# Altium project PCB_Project.PrjPcb (part 1 of 2)
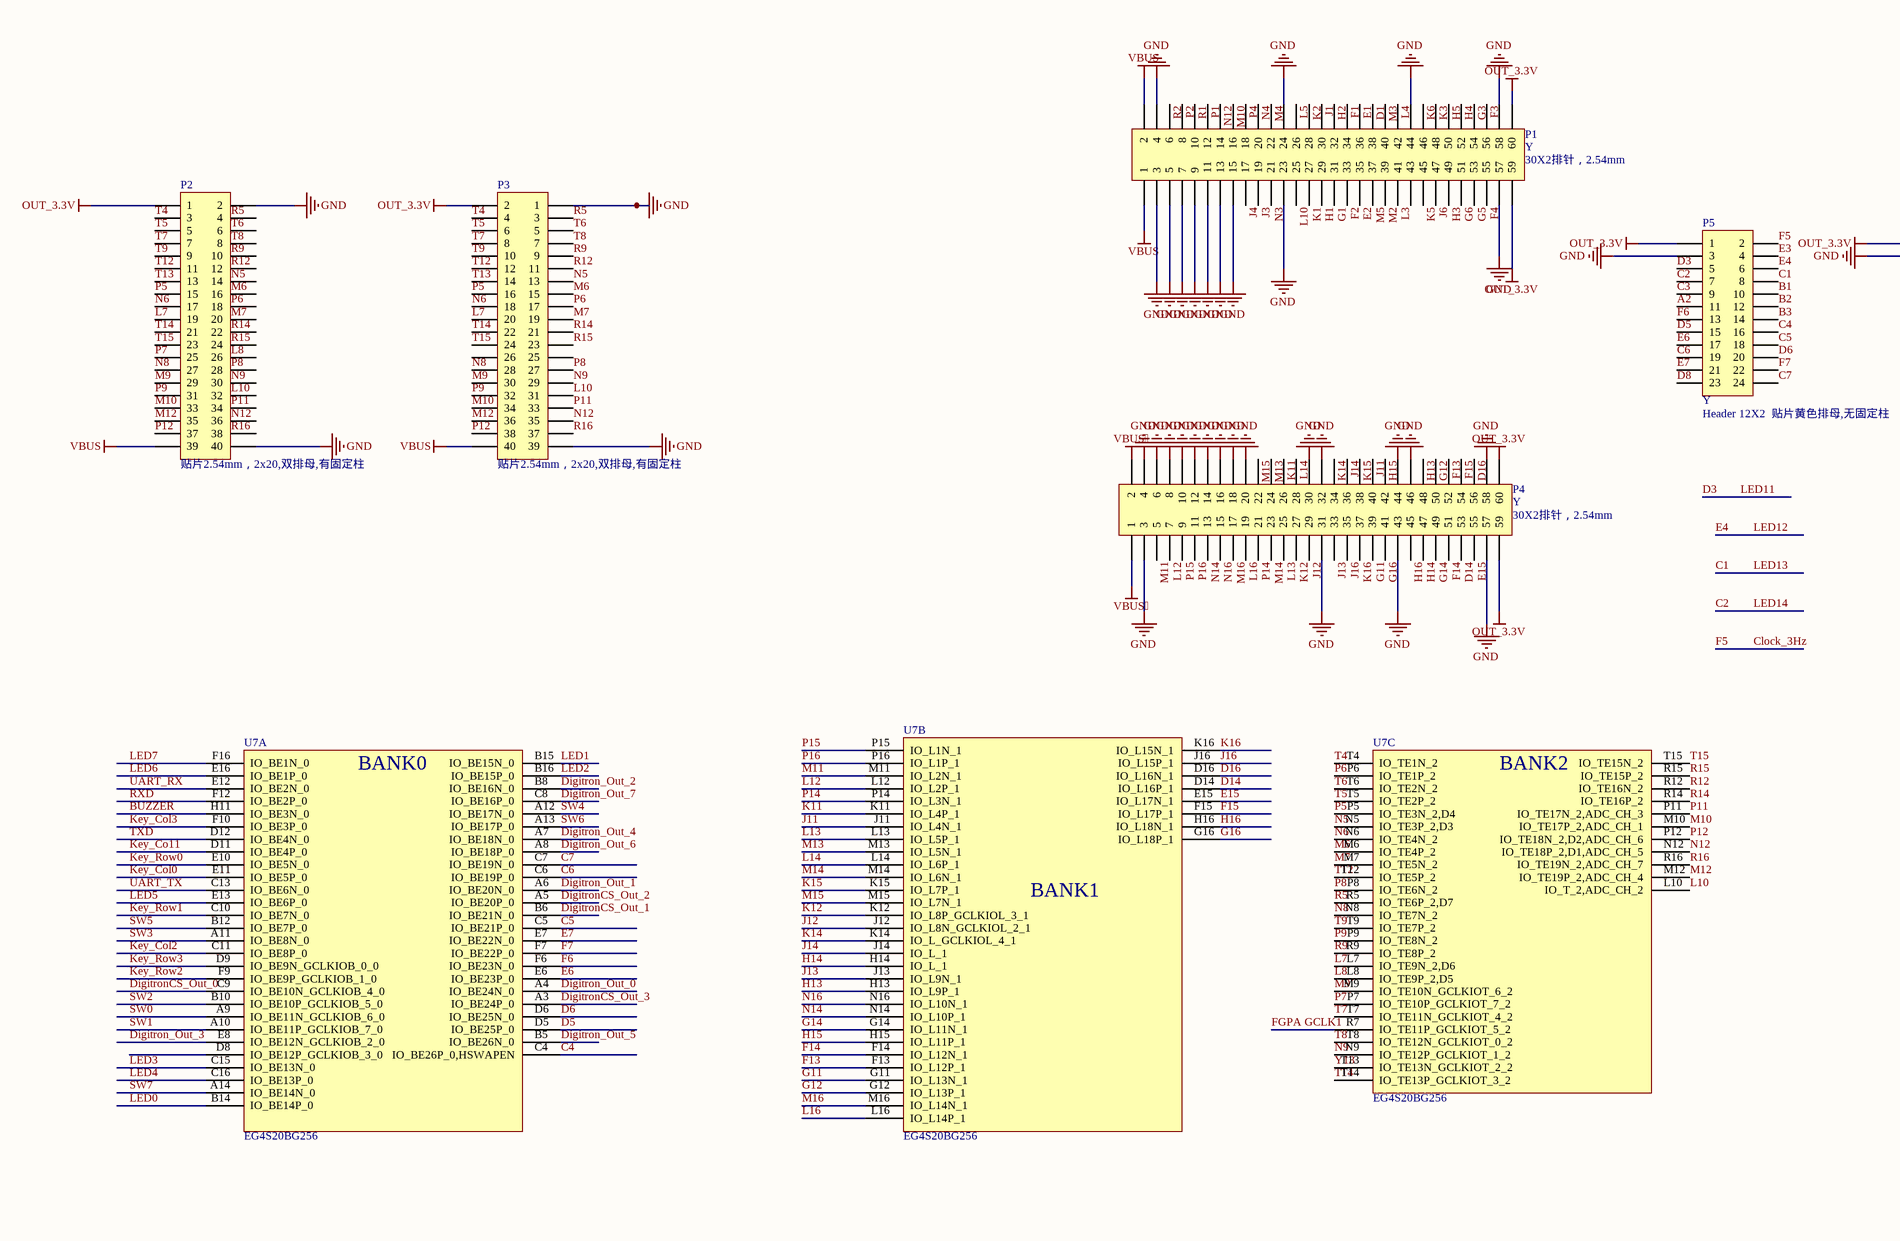
[diagram p0: Sheet1.SchDoc, top left]
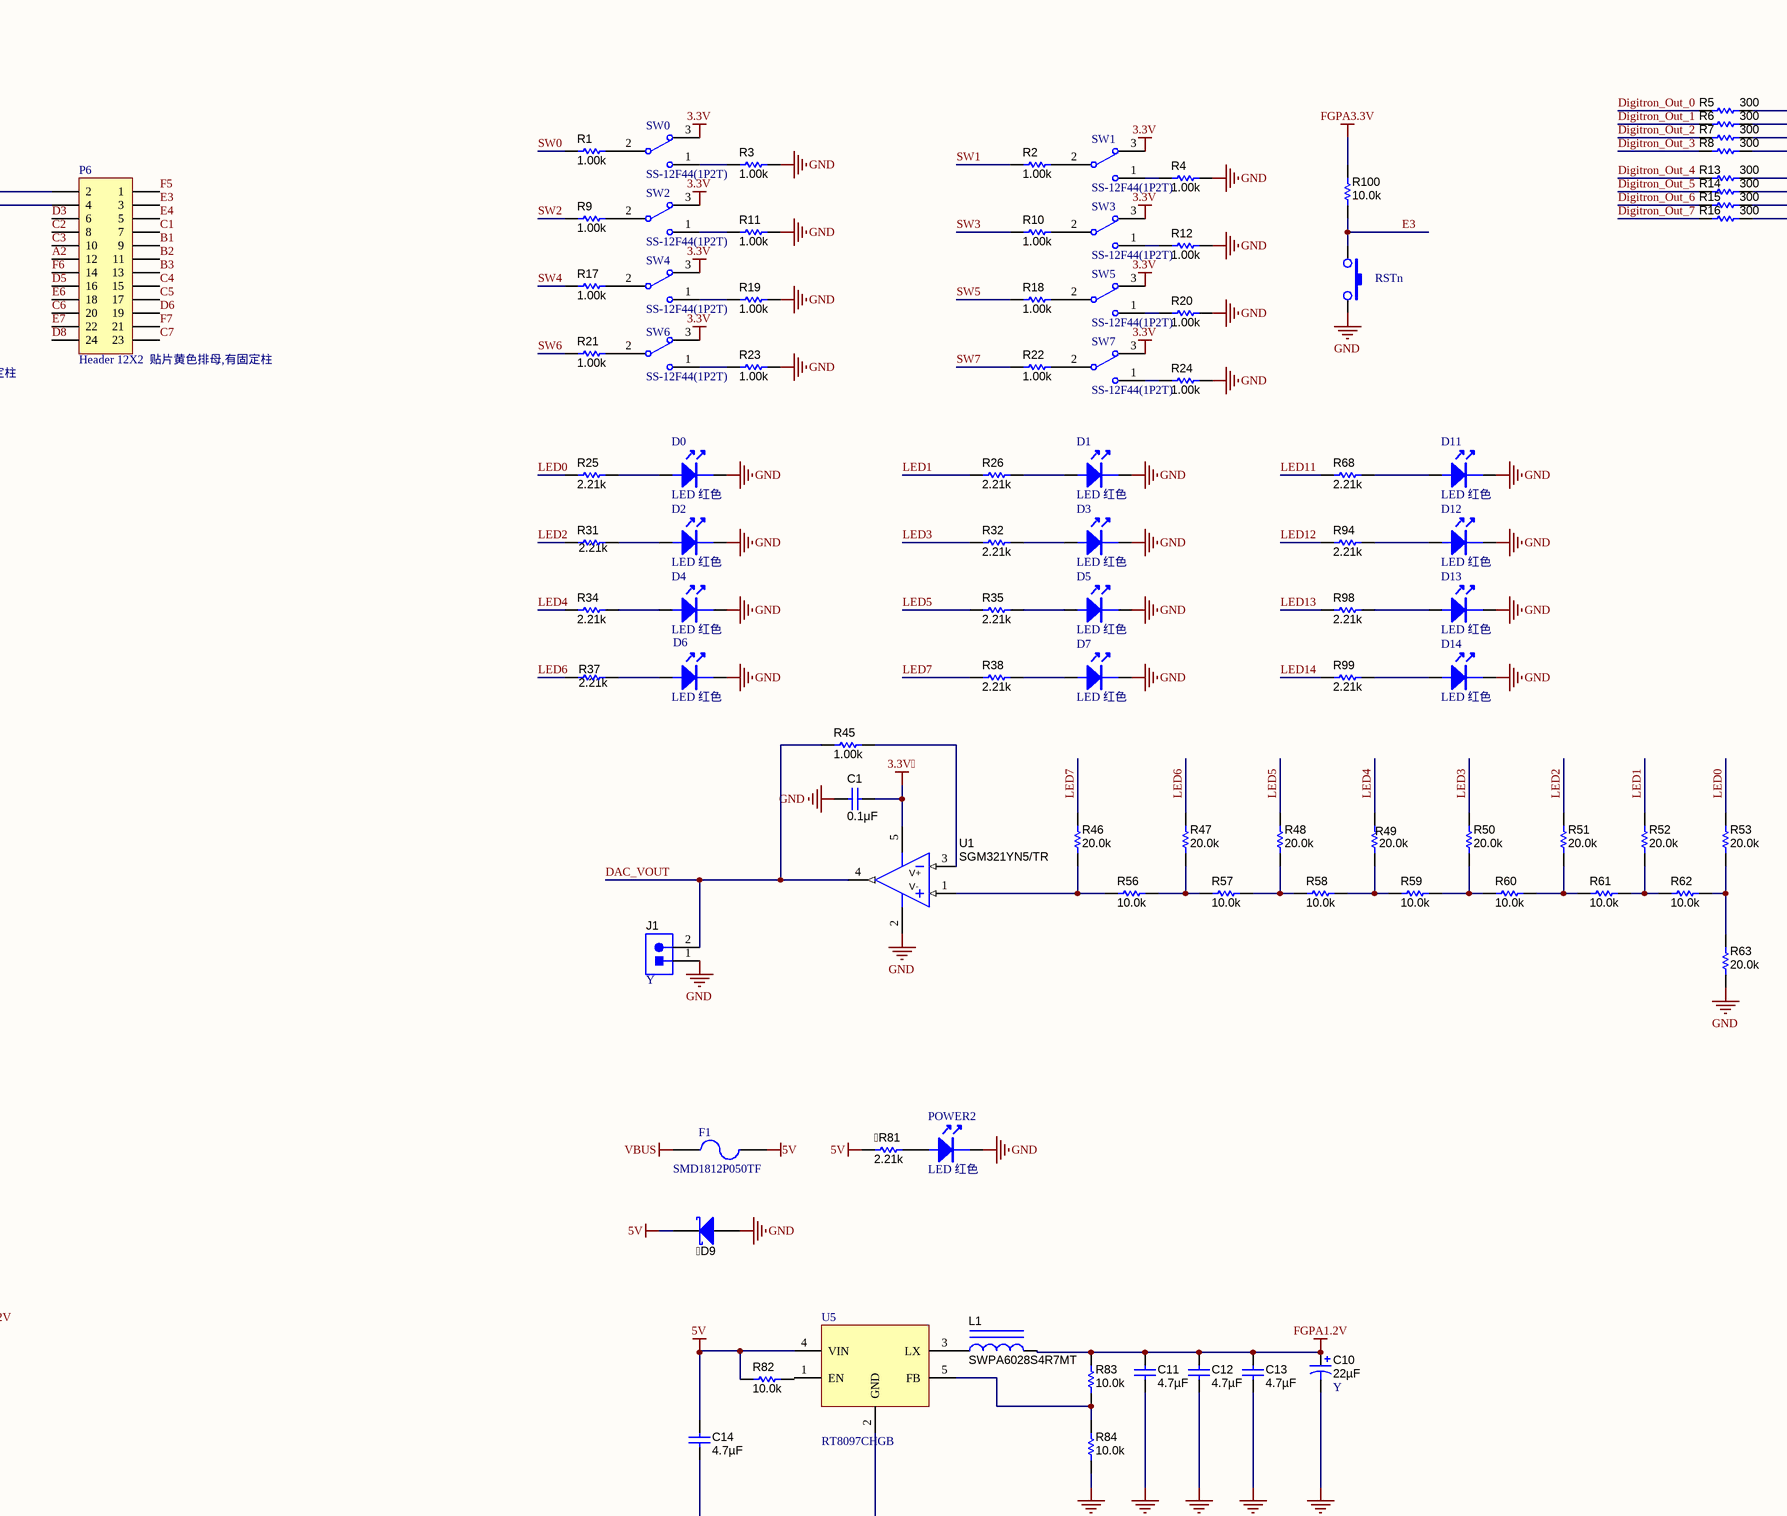
[diagram p1: Sheet1.SchDoc, top middle]
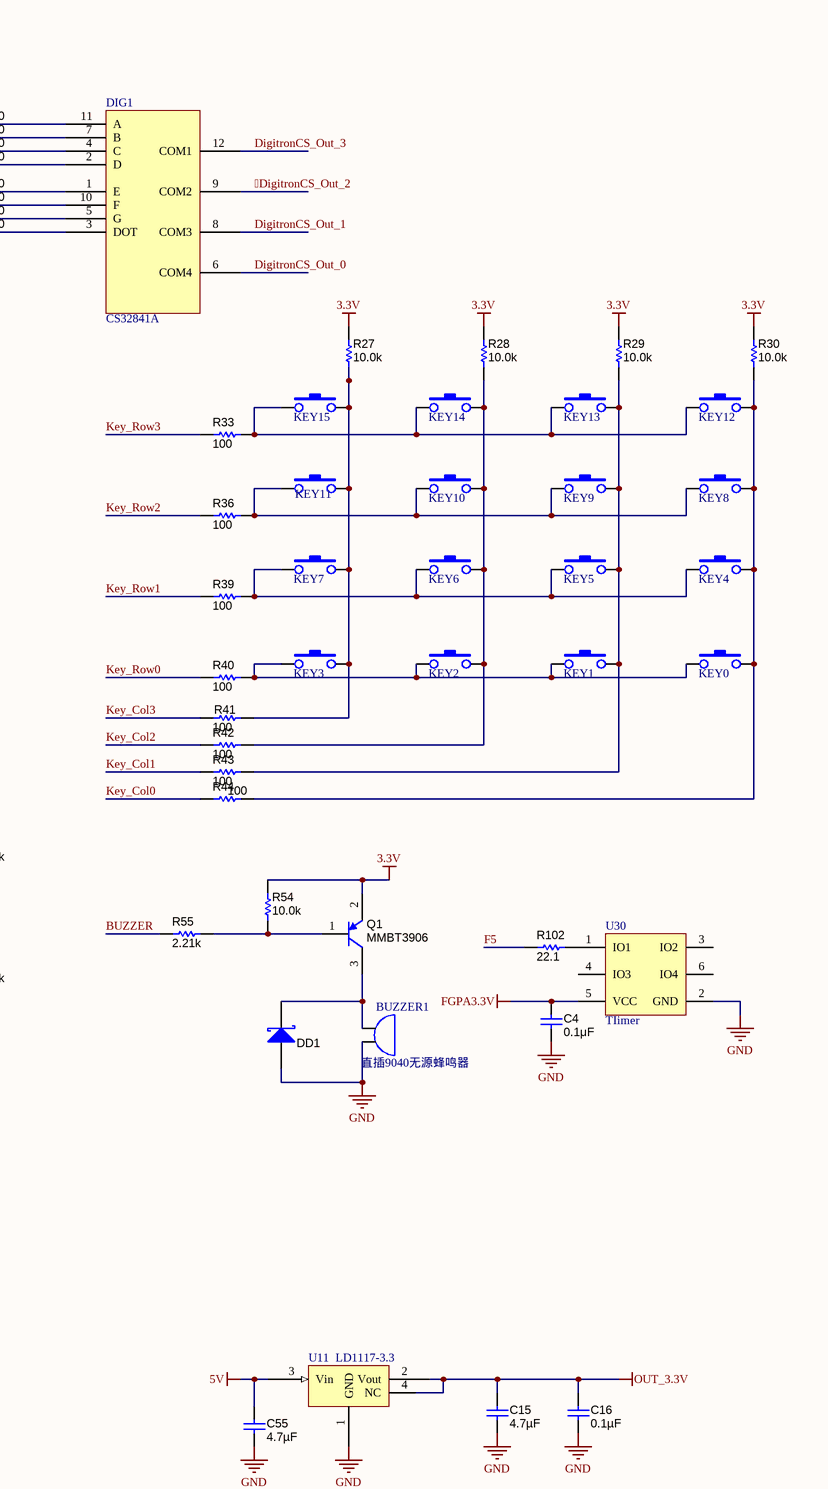
[diagram p2: Sheet1.SchDoc, top right]
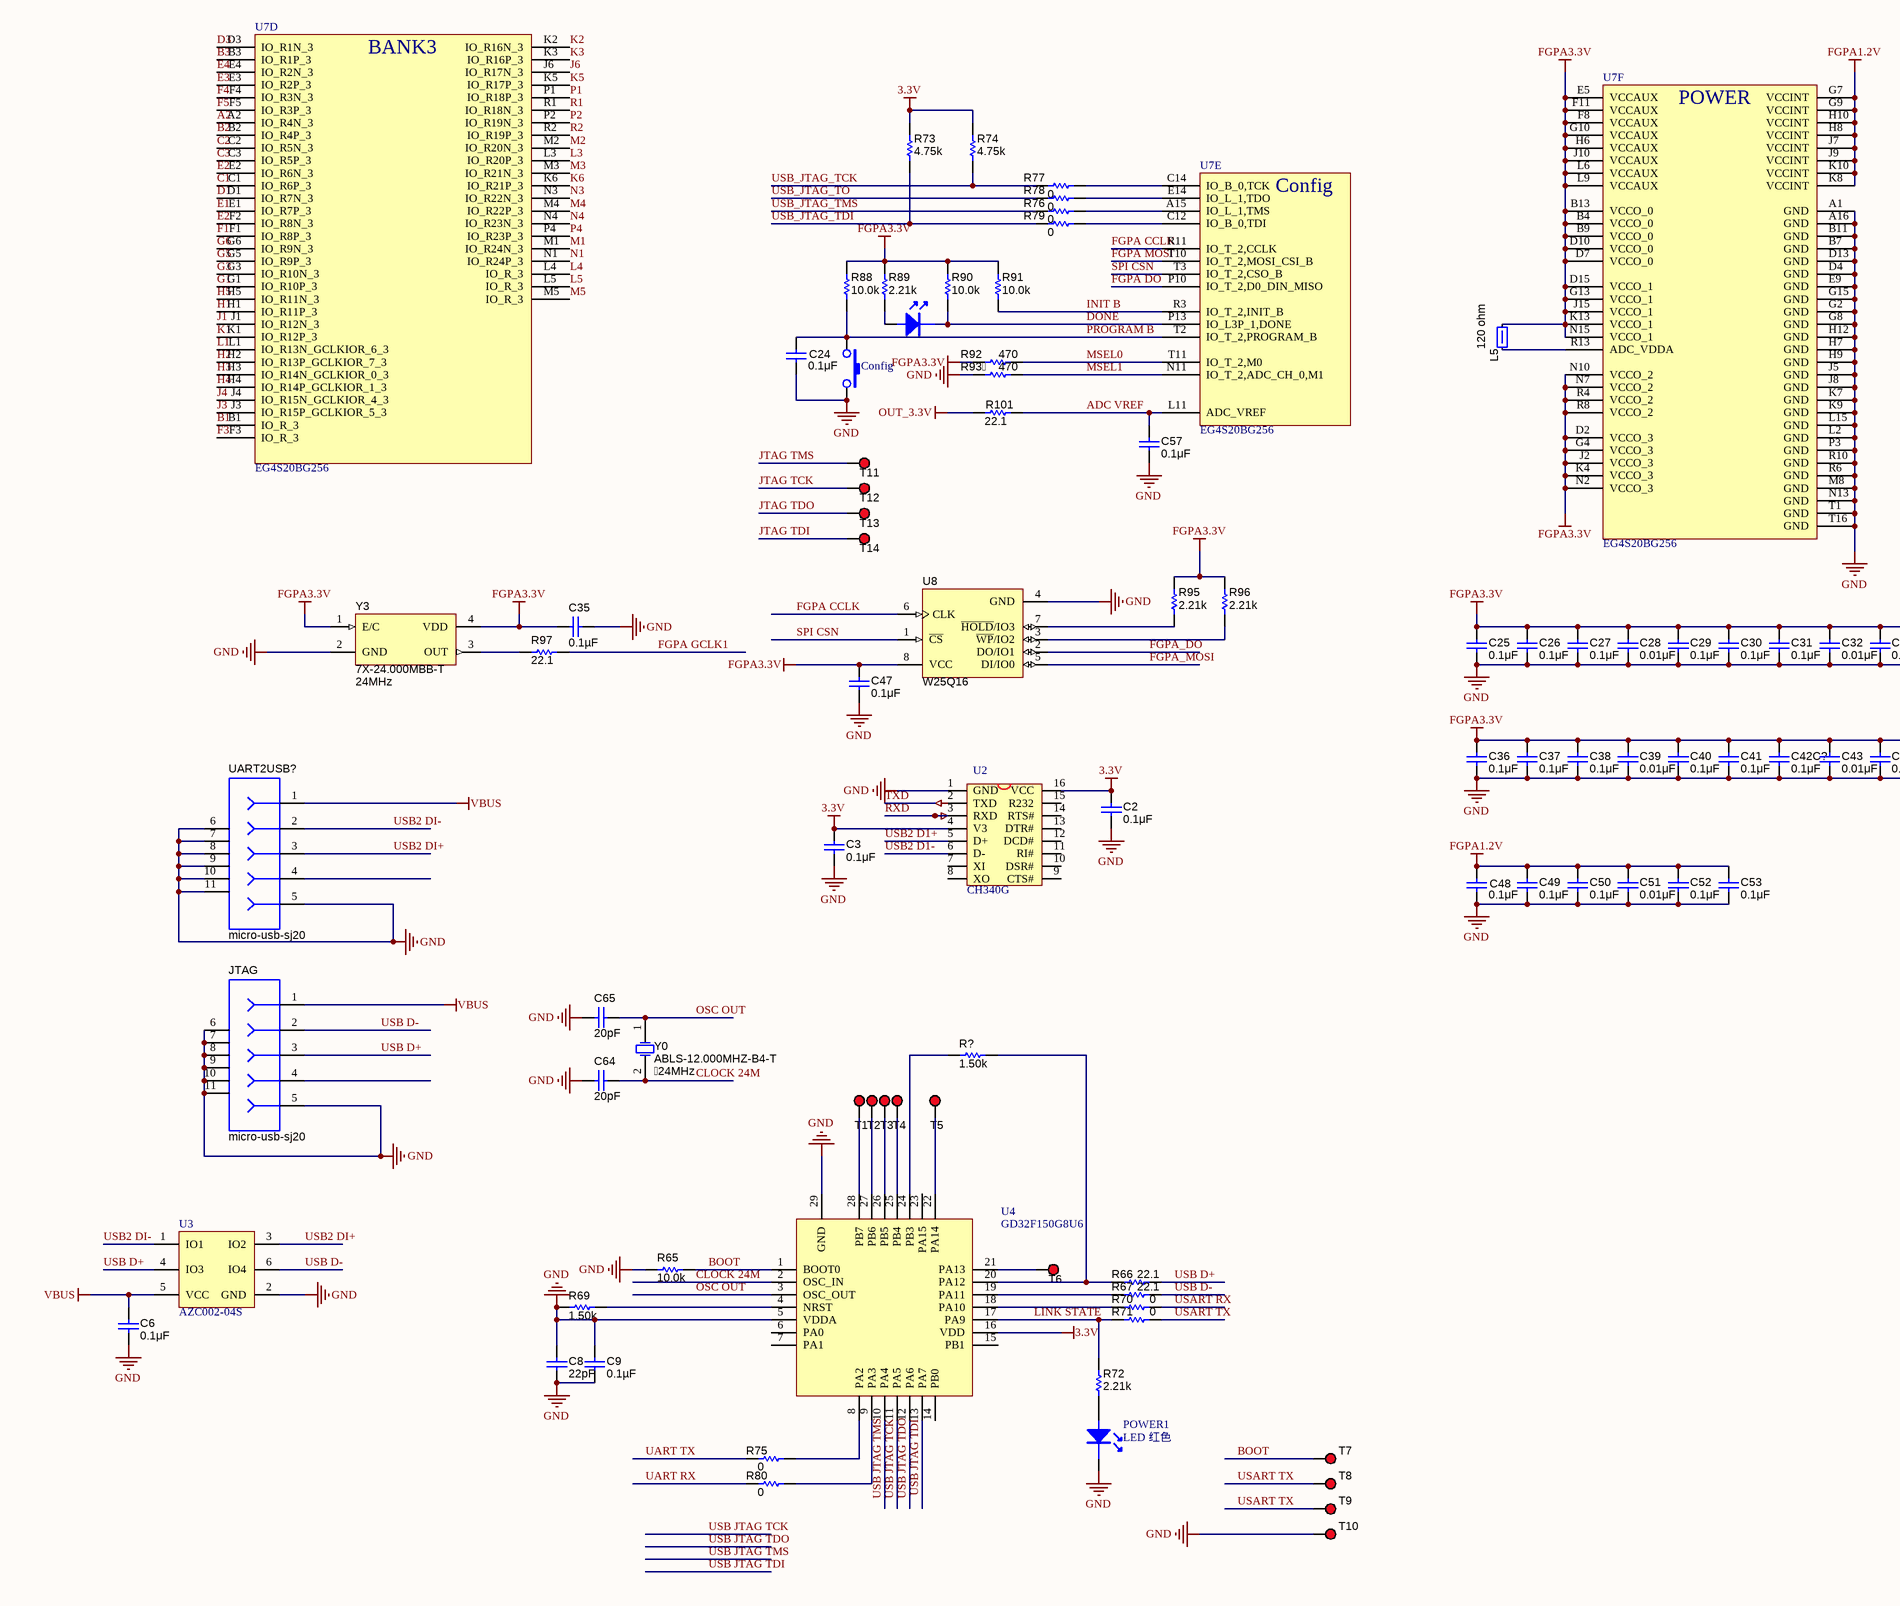
[diagram p3: Sheet1.SchDoc, bottom left]
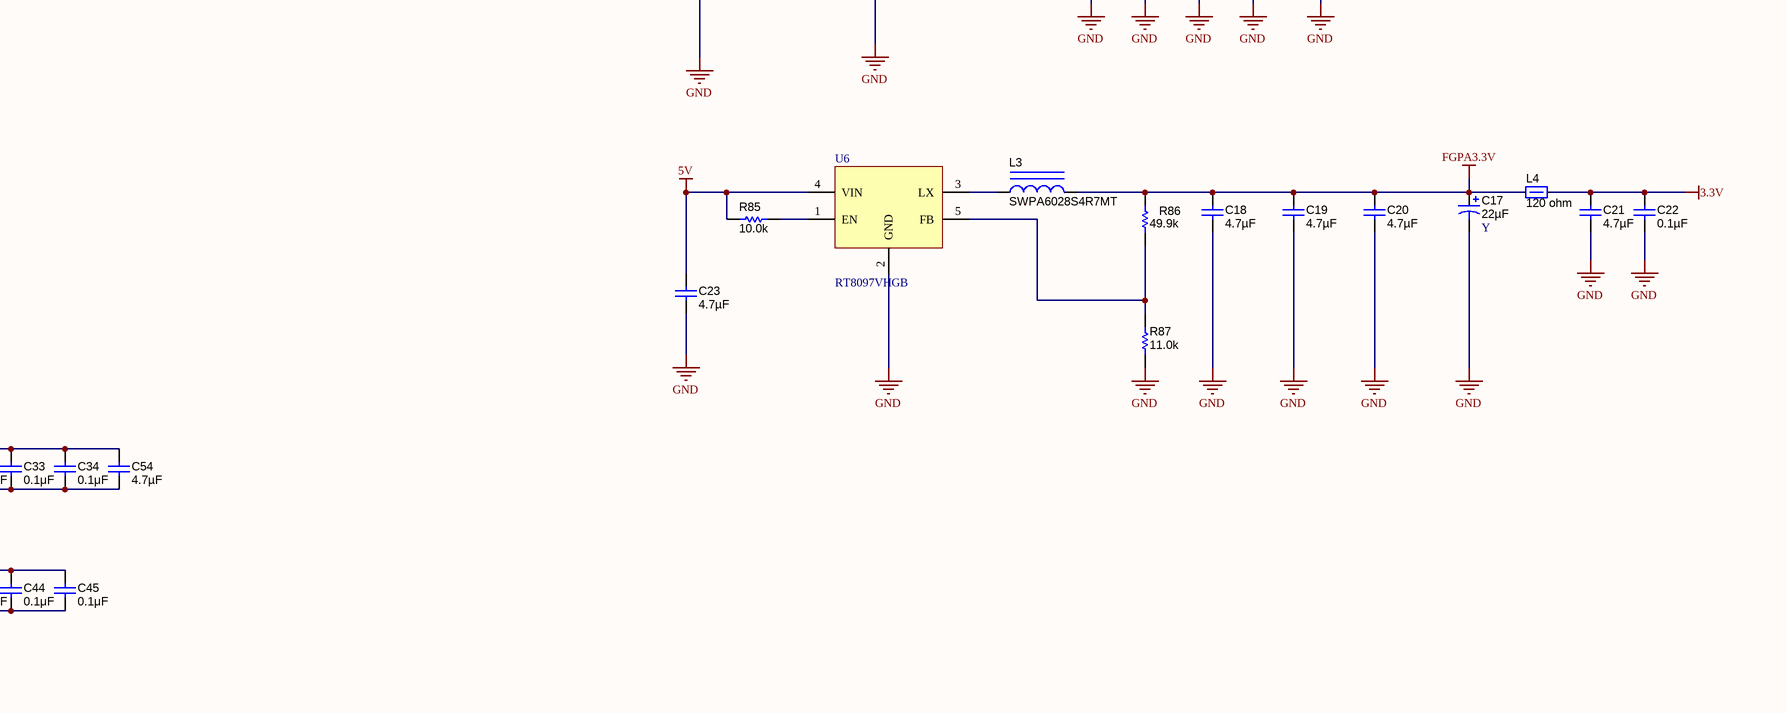
[diagram p4: Sheet1.SchDoc, bottom middle]
1 sheet, 243 parts. Net scope: global (net labels, ports and power ports of the same name join across sheets).
Board file: PCB1.PcbDoc

## Sheet Sheet1.SchDoc
size A0; SheetNumber: 1; SheetTotal: 1

### Parts
D9  1N5819  [SOD-123F]  (value not drawn)
R81  ValueDisplayed: 2.21k  [0402]  (hidden comment: CRCW04022K21FKED)
?  (no value)  [LED_LTST-C170]
BUZZER1  直插9040无源蜂鸣器  [BUZZER_9*9_4MM]
C1  ValueDisplayed: 0.1μF  [0402]  (hidden comment: C1005X7R1H104M)
C2  ValueDisplayed: 0.1μF  [0402]  (hidden comment: C1005X7R1H104M)
C3  ValueDisplayed: 0.1μF  [0402]  (hidden comment: C1005X7R1H104M)
C4  ValueDisplayed: 0.1μF  [0402]  (hidden comment: C1005X7R1H104M)
C6  ValueDisplayed: 0.1μF  [0402]  (hidden comment: C1005X7R1H104M)
C8  ValueDisplayed: 22pF  [0402]  (hidden comment: GRM1555C1H220FA01D)
C9  ValueDisplayed: 0.1µF  [0402]  (hidden comment: C1005X7R1H104M)
C10  ValueDisplayed: 22µF  [6032-28]  (hidden comment: Y)
C11  ValueDisplayed: 4.7µF  [0805_HV]  (hidden comment: GRM21BC81C475KA88L)
C12  ValueDisplayed: 4.7µF  [0805_HV]  (hidden comment: GRM21BC81C475KA88L)
C13  ValueDisplayed: 4.7µF  [0805_HV]  (hidden comment: GRM21BC81C475KA88L)
C14  ValueDisplayed: 4.7µF  [0805_HV]  (hidden comment: GRM21BC81C475KA88L)
C15  ValueDisplayed: 4.7µF  [0805_HV]  (hidden comment: GRM21BC81C475KA88L)
C16  ValueDisplayed: 0.1µF  [0402]  (hidden comment: C1005X7R1H104M)
C17  ValueDisplayed: 22µF  [6032-28]  (hidden comment: Y)
C18  ValueDisplayed: 4.7µF  [0805_HV]  (hidden comment: GRM21BC81C475KA88L)
C19  ValueDisplayed: 4.7µF  [0805_HV]  (hidden comment: GRM21BC81C475KA88L)
C20  ValueDisplayed: 4.7µF  [0805_HV]  (hidden comment: GRM21BC81C475KA88L)
C21  ValueDisplayed: 4.7µF  [0805_HV]  (hidden comment: GRM21BC81C475KA88L)
C22  ValueDisplayed: 0.1µF  [0402]  (hidden comment: C1005X7R1H104M)
C23  ValueDisplayed: 4.7µF  [0805_HV]  (hidden comment: GRM21BC81C475KA88L)
C24  ValueDisplayed: 0.1μF  [0402]  (hidden comment: C1005X7R1H104M)
C25  ValueDisplayed: 0.1μF  [0402]  (hidden comment: C1005X7R1H104M)
C26  ValueDisplayed: 0.1μF  [0402]  (hidden comment: C1005X7R1H104M)
C27  ValueDisplayed: 0.1μF  [0402]  (hidden comment: C1005X7R1H104M)
C28  ValueDisplayed: 0.01μF  [0402]  (hidden comment: C0402C103J5RACTU)
C29  ValueDisplayed: 0.1μF  [0402]  (hidden comment: C1005X7R1H104M)
C30  ValueDisplayed: 0.1μF  [0402]  (hidden comment: C1005X7R1H104M)
C31  ValueDisplayed: 0.1μF  [0402]  (hidden comment: C1005X7R1H104M)
C32  ValueDisplayed: 0.01μF  [0402]  (hidden comment: C0402C103J5RACTU)
C33  ValueDisplayed: 0.1μF  [0402]  (hidden comment: C1005X7R1H104M)
C34  ValueDisplayed: 0.1μF  [0402]  (hidden comment: C1005X7R1H104M)
C35  ValueDisplayed: 0.1µF  [0402]  (hidden comment: C1005X7R1H104M)
C36  ValueDisplayed: 0.1μF  [0402]  (hidden comment: C1005X7R1H104M)
C37  ValueDisplayed: 0.1μF  [0402]  (hidden comment: C1005X7R1H104M)
C38  ValueDisplayed: 0.1μF  [0402]  (hidden comment: C1005X7R1H104M)
C39  ValueDisplayed: 0.01μF  [0402]  (hidden comment: C0402C103J5RACTU)
C40  ValueDisplayed: 0.1μF  [0402]  (hidden comment: C1005X7R1H104M)
C41  ValueDisplayed: 0.1μF  [0402]  (hidden comment: C1005X7R1H104M)
C42C?  ValueDisplayed: 0.1μF  [0402]  (hidden comment: C1005X7R1H104M)
C43  ValueDisplayed: 0.01μF  [0402]  (hidden comment: C0402C103J5RACTU)
C44  ValueDisplayed: 0.1μF  [0402]  (hidden comment: C1005X7R1H104M)
C45  ValueDisplayed: 0.1μF  [0402]  (hidden comment: C1005X7R1H104M)
C47  ValueDisplayed: 0.1μF  [0402]  (hidden comment: C1005X7R1H104M)
C48  ValueDisplayed: 0.1μF  [0402]  (hidden comment: C1005X7R1H104M)
C49  ValueDisplayed: 0.1μF  [0402]  (hidden comment: C1005X7R1H104M)
C50  ValueDisplayed: 0.1μF  [0402]  (hidden comment: C1005X7R1H104M)
C51  ValueDisplayed: 0.01μF  [0402]  (hidden comment: C0402C103J5RACTU)
C52  ValueDisplayed: 0.1μF  [0402]  (hidden comment: C1005X7R1H104M)
C53  ValueDisplayed: 0.1μF  [0402]  (hidden comment: C1005X7R1H104M)
C54  ValueDisplayed: 4.7µF  [0805_HV]  (hidden comment: GRM21BC81C475KA88L)
C55  ValueDisplayed: 4.7µF  [0805_HV]  (hidden comment: GRM21BC81C475KA88L)
C57  ValueDisplayed: 0.1μF  [0402]  (hidden comment: C1005X7R1H104M)
C64  ValueDisplayed: 20pF  [0402]  (hidden comment: GRM1555C1H220FA01D)
C65  ValueDisplayed: 20pF  [0402]  (hidden comment: GRM1555C1H220FA01D)
Config  贴片按键  [BUTTOM_T_6*6 *4.3]  (value not drawn)
D0  LED 红色  [LED_LTST-C170]
D1  LED 红色  [LED_LTST-C170]
D2  LED 红色  [LED_LTST-C170]
D3  LED 红色  [LED_LTST-C170]
D4  LED 红色  [LED_LTST-C170]
D5  LED 红色  [LED_LTST-C170]
D6  LED 红色  [LED_LTST-C170]
D7  LED 红色  [LED_LTST-C170]
D11  LED 红色  [LED_LTST-C170]
D12  LED 红色  [LED_LTST-C170]
D13  LED 红色  [LED_LTST-C170]
D14  LED 红色  [LED_LTST-C170]
DD1  1N5819  [SOD-123F]  (value not drawn)
DIG1  CS32841A  [CS2845AUR]
F1  SMD1812P050TF  [1812]
J1  Y  [Samtec_HTSW-102-07-G-S]
JTAG  micro-usb-sj20  [YQMICRO-USB-SJ20]
KEY0  贴片按键  [BUTTOM_T_6*6 *4.3]  (value not drawn)
KEY1  贴片按键  [BUTTOM_T_6*6 *4.3]  (value not drawn)
KEY2  贴片按键  [BUTTOM_T_6*6 *4.3]  (value not drawn)
KEY3  贴片按键  [BUTTOM_T_6*6 *4.3]  (value not drawn)
KEY4  贴片按键  [BUTTOM_T_6*6 *4.3]  (value not drawn)
KEY5  贴片按键  [BUTTOM_T_6*6 *4.3]  (value not drawn)
KEY6  贴片按键  [BUTTOM_T_6*6 *4.3]  (value not drawn)
KEY7  贴片按键  [BUTTOM_T_6*6 *4.3]  (value not drawn)
KEY8  贴片按键  [BUTTOM_T_6*6 *4.3]  (value not drawn)
KEY9  贴片按键  [BUTTOM_T_6*6 *4.3]  (value not drawn)
KEY10  贴片按键  [BUTTOM_T_6*6 *4.3]  (value not drawn)
KEY11  贴片按键  [BUTTOM_T_6*6 *4.3]  (value not drawn)
KEY12  贴片按键  [BUTTOM_T_6*6 *4.3]  (value not drawn)
KEY13  贴片按键  [BUTTOM_T_6*6 *4.3]  (value not drawn)
KEY14  贴片按键  [BUTTOM_T_6*6 *4.3]  (value not drawn)
KEY15  贴片按键  [BUTTOM_T_6*6 *4.3]  (value not drawn)
L1  SWPA6028S4R7MT  [LPS6225]
L3  SWPA6028S4R7MT  [LPS6225]
L4  value 120 ohm  [0805_HV]  (hidden comment: GZ2012V121TF)
L5  value 120 ohm  [0805_HV]  (hidden comment: GZ2012V121TF)
P1  Y  Parameter: 30X2排针，2.54mm  [HDR2X30]
P2  贴片2.54mm，2x20,双排母,有固定柱  [DC3-40P-T-MIMI]
P3  贴片2.54mm，2x20,双排母,有固定柱  [DC3-40P-T-MIMI]
P4  Y  Parameter: 30X2排针，2.54mm  [HDR2X30]
P5  Y  Parameter: Header 12X2  贴片黄色排母,无固定柱  [YQ2*12-SMT]
P6  Header 12X2  贴片黄色排母,有固定柱  [YQ2*12-SMT]
POWER1  LED 红色  [LED_LTST-C170]
POWER2  LED 红色  [LED_LTST-C170]
Q1  MMBT3906  [SOT-23]
R1  ValueDisplayed: 1.00k  [0402]  (hidden comment: CRCW04021K00FKED)
R2  ValueDisplayed: 1.00k  [0402]  (hidden comment: CRCW04021K00FKED)
R3  ValueDisplayed: 1.00k  [0402]  (hidden comment: CRCW04021K00FKED)
R4  ValueDisplayed: 1.00k  [0402]  (hidden comment: CRCW04021K00FKED)
R5  ValueDisplayed: 300  [0402]  (hidden comment: RG1005P-301-B-T5)
R6  ValueDisplayed: 300  [0402]  (hidden comment: RG1005P-301-B-T5)
R7  ValueDisplayed: 300  [0402]  (hidden comment: RG1005P-301-B-T5)
R8  ValueDisplayed: 300  [0402]  (hidden comment: RG1005P-301-B-T5)
R9  ValueDisplayed: 1.00k  [0402]  (hidden comment: CRCW04021K00FKED)
R10  ValueDisplayed: 1.00k  [0402]  (hidden comment: CRCW04021K00FKED)
R11  ValueDisplayed: 1.00k  [0402]  (hidden comment: CRCW04021K00FKED)
R12  ValueDisplayed: 1.00k  [0402]  (hidden comment: CRCW04021K00FKED)
R13  ValueDisplayed: 300  [0402]  (hidden comment: RG1005P-301-B-T5)
R14  ValueDisplayed: 300  [0402]  (hidden comment: RG1005P-301-B-T5)
R15  ValueDisplayed: 300  [0402]  (hidden comment: RG1005P-301-B-T5)
R16  ValueDisplayed: 300  [0402]  (hidden comment: RG1005P-301-B-T5)
R17  ValueDisplayed: 1.00k  [0402]  (hidden comment: CRCW04021K00FKED)
R18  ValueDisplayed: 1.00k  [0402]  (hidden comment: CRCW04021K00FKED)
R19  ValueDisplayed: 1.00k  [0402]  (hidden comment: CRCW04021K00FKED)
R20  ValueDisplayed: 1.00k  [0402]  (hidden comment: CRCW04021K00FKED)
R21  ValueDisplayed: 1.00k  [0402]  (hidden comment: CRCW04021K00FKED)
R22  ValueDisplayed: 1.00k  [0402]  (hidden comment: CRCW04021K00FKED)
R23  ValueDisplayed: 1.00k  [0402]  (hidden comment: CRCW04021K00FKED)
R24  ValueDisplayed: 1.00k  [0402]  (hidden comment: CRCW04021K00FKED)
R25  ValueDisplayed: 2.21k  [0402]  (hidden comment: CRCW04022K21FKED)
R26  ValueDisplayed: 2.21k  [0402]  (hidden comment: CRCW04022K21FKED)
R27  ValueDisplayed: 10.0k  [0402]  (hidden comment: CRCW040210K0FKED)
R28  ValueDisplayed: 10.0k  [0402]  (hidden comment: CRCW040210K0FKED)
R29  ValueDisplayed: 10.0k  [0402]  (hidden comment: CRCW040210K0FKED)
R30  ValueDisplayed: 10.0k  [0402]  (hidden comment: CRCW040210K0FKED)
R31  ValueDisplayed: 2.21k  [0402]  (hidden comment: CRCW04022K21FKED)
R32  ValueDisplayed: 2.21k  [0402]  (hidden comment: CRCW04022K21FKED)
R33  ValueDisplayed: 100  [0402]  (hidden comment: CRCW0402100RFKED)
R34  ValueDisplayed: 2.21k  [0402]  (hidden comment: CRCW04022K21FKED)
R35  ValueDisplayed: 2.21k  [0402]  (hidden comment: CRCW04022K21FKED)
R36  ValueDisplayed: 100  [0402]  (hidden comment: CRCW0402100RFKED)
R37  ValueDisplayed: 2.21k  [0402]  (hidden comment: CRCW04022K21FKED)
R38  ValueDisplayed: 2.21k  [0402]  (hidden comment: CRCW04022K21FKED)
R39  ValueDisplayed: 100  [0402]  (hidden comment: CRCW0402100RFKED)
R40  ValueDisplayed: 100  [0402]  (hidden comment: CRCW0402100RFKED)
R41  ValueDisplayed: 100  [0402]  (hidden comment: CRCW0402100RFKED)
R42  ValueDisplayed: 100  [0402]  (hidden comment: CRCW0402100RFKED)
R43  ValueDisplayed: 100  [0402]  (hidden comment: CRCW0402100RFKED)
R44  ValueDisplayed: 100  [0402]  (hidden comment: CRCW0402100RFKED)
R45  ValueDisplayed: 1.00k  [0402]  (hidden comment: CRCW04021K00FKED)
R46  ValueDisplayed: 20.0k  [0402]  (hidden comment: CRCW040220K0FKED)
R47  ValueDisplayed: 20.0k  [0402]  (hidden comment: CRCW040220K0FKED)
R48  ValueDisplayed: 20.0k  [0402]  (hidden comment: CRCW040220K0FKED)
R49  ValueDisplayed: 20.0k  [0402]  (hidden comment: CRCW040220K0FKED)
R50  ValueDisplayed: 20.0k  [0402]  (hidden comment: CRCW040220K0FKED)
R51  ValueDisplayed: 20.0k  [0402]  (hidden comment: CRCW040220K0FKED)
R52  ValueDisplayed: 20.0k  [0402]  (hidden comment: CRCW040220K0FKED)
R53  ValueDisplayed: 20.0k  [0402]  (hidden comment: CRCW040220K0FKED)
R54  ValueDisplayed: 10.0k  [0402]  (hidden comment: CRCW040210K0FKED)
R55  ValueDisplayed: 2.21k  [0402]  (hidden comment: CRCW04022K21FKED)
R56  ValueDisplayed: 10.0k  [0402]  (hidden comment: CRCW040210K0FKED)
R57  ValueDisplayed: 10.0k  [0402]  (hidden comment: CRCW040210K0FKED)
R58  ValueDisplayed: 10.0k  [0402]  (hidden comment: CRCW040210K0FKED)
R59  ValueDisplayed: 10.0k  [0402]  (hidden comment: CRCW040210K0FKED)
R60  ValueDisplayed: 10.0k  [0402]  (hidden comment: CRCW040210K0FKED)
R61  ValueDisplayed: 10.0k  [0402]  (hidden comment: CRCW040210K0FKED)
R62  ValueDisplayed: 10.0k  [0402]  (hidden comment: CRCW040210K0FKED)
R63  ValueDisplayed: 20.0k  [0402]  (hidden comment: CRCW040220K0FKED)
R65  ValueDisplayed: 10.0k  [0402]  (hidden comment: CRCW040210K0FKED)
R66  ValueDisplayed: 22.1  [0402]  (hidden comment: CRCW040222R1FKED)
R67  ValueDisplayed: 22.1  [0402]  (hidden comment: CRCW040222R1FKED)
R68  ValueDisplayed: 2.21k  [0402]  (hidden comment: CRCW04022K21FKED)
R69  ValueDisplayed: 1.50k  [0402]  (hidden comment: CRCW04021K50FKED)
R70  ValueDisplayed: 0  [0402]  (hidden comment: CRCW04020000Z0ED)
R71  ValueDisplayed: 0  [0402]  (hidden comment: CRCW04020000Z0ED)
R72  ValueDisplayed: 2.21k  [0402]  (hidden comment: CRCW04022K21FKED)
R73  ValueDisplayed: 4.75k  [0402]  (hidden comment: CRCW04024K75FKED)
R74  ValueDisplayed: 4.75k  [0402]  (hidden comment: CRCW04024K75FKED)
R75  ValueDisplayed: 0  [0402]  (hidden comment: CRCW04020000Z0ED)
R76  ValueDisplayed: 0  [0402]  (hidden comment: CRCW04020000Z0ED)
R77  ValueDisplayed: 0  [0402]  (hidden comment: CRCW04020000Z0ED)
R78  ValueDisplayed: 0  [0402]  (hidden comment: CRCW04020000Z0ED)
R79  ValueDisplayed: 0  [0402]  (hidden comment: CRCW04020000Z0ED)
R80  ValueDisplayed: 0  [0402]  (hidden comment: CRCW04020000Z0ED)
R82  ValueDisplayed: 10.0k  [0402]  (hidden comment: CRCW040210K0FKED)
R83  ValueDisplayed: 10.0k  [0402]  (hidden comment: CRCW040210K0FKED)
R84  ValueDisplayed: 10.0k  [0402]  (hidden comment: CRCW040210K0FKED)
R85  ValueDisplayed: 10.0k  [0402]  (hidden comment: CRCW040210K0FKED)
R86  ValueDisplayed: 49.9k  [0402]  (hidden comment: CRCW040249K9FKED)
R87  ValueDisplayed: 11.0k  [0402]  (hidden comment: CRCW040211K0FKED)
R88  ValueDisplayed: 10.0k  [0402]  (hidden comment: CRCW040210K0FKED)
R89  ValueDisplayed: 2.21k  [0402]  (hidden comment: CRCW04022K21FKED)
R90  ValueDisplayed: 10.0k  [0402]  (hidden comment: CRCW040210K0FKED)
R91  ValueDisplayed: 10.0k  [0402]  (hidden comment: CRCW040210K0FKED)
R92  ValueDisplayed: 470  [0402]  (hidden comment: CRCW0402470RJNED)
R93  ValueDisplayed: 470  [0402]  (hidden comment: CRCW0402470RJNED)
R94  ValueDisplayed: 2.21k  [0402]  (hidden comment: CRCW04022K21FKED)
R95  ValueDisplayed: 2.21k  [0402]  (hidden comment: CRCW04022K21FKED)
R96  ValueDisplayed: 2.21k  [0402]  (hidden comment: CRCW04022K21FKED)
R97  ValueDisplayed: 22.1  [0402]  (hidden comment: CRCW040222R1FKED)
R98  ValueDisplayed: 2.21k  [0402]  (hidden comment: CRCW04022K21FKED)
R99  ValueDisplayed: 2.21k  [0402]  (hidden comment: CRCW04022K21FKED)
R100  ValueDisplayed: 10.0k  [0402]  (hidden comment: CRCW040210K0FKED)
R101  ValueDisplayed: 22.1  [0402]  (hidden comment: CRCW040222R1FKED)
R102  ValueDisplayed: 22.1  [0402]  (hidden comment: CRCW040222R1FKED)
R?  ValueDisplayed: 1.50k  [0402]  (hidden comment: CRCW04021K50FKED)
RSTn  贴片按键  [BUTTOM_T_6*6 *4.3]  (value not drawn)
SW0  SS-12F44(1P2T)  [SS-12F44(1P2T)]
SW1  SS-12F44(1P2T)  [SS-12F44(1P2T)]
SW2  SS-12F44(1P2T)  [SS-12F44(1P2T)]
SW3  SS-12F44(1P2T)  [SS-12F44(1P2T)]
SW4  SS-12F44(1P2T)  [SS-12F44(1P2T)]
SW5  SS-12F44(1P2T)  [SS-12F44(1P2T)]
SW6  SS-12F44(1P2T)  [SS-12F44(1P2T)]
SW7  SS-12F44(1P2T)  [SS-12F44(1P2T)]
T1  5000  [TP]  (value not drawn)
T2  5000  [TP]  (value not drawn)
T3  5000  [TP]  (value not drawn)
T4  5000  [TP]  (value not drawn)
T5  5000  [TP]  (value not drawn)
T6  5000  [TP]  (value not drawn)
T7  5000  [TP]  (value not drawn)
T8  5000  [TP]  (value not drawn)
T9  5000  [TP]  (value not drawn)
T10  5000  [TP]  (value not drawn)
T11  5000  [TP]  (value not drawn)
T12  5000  [TP]  (value not drawn)
T13  5000  [TP]  (value not drawn)
T14  5000  [TP]  (value not drawn)
U1  SGM321YN5/TR  [DBV0005A_N]
U2  CH340G  [SOP16M]
U3  AZC002-04S  [DBV0006A_N]
U4  GD32F150G8U6  [WQFN-28_L4.0-W4.0-P0.40-BL-EP]
U5  RT8097CHGB  [DBV0005A_N]
U6  RT8097VHGB  [DBV0005A_N]
U7  EG4S20BG256  [FBGA256]  (parts A,B,C,D,E,F of 6)
U8  W25Q16  [MICT-MW-8_N]
U11  LD1117-3.3  [SOT223-L]
U30  TIimer  [DBV0006A_N]
UART2USB?  micro-usb-sj20  [YQMICRO-USB-SJ20]
Y0  ABLS-12.000MHZ-B4-T  Frequency: 24MHz  [YQ_OSC5032]
Y3  7X-24.000MBB-T  Frequency: 24MHz  [XTAL_NX3225SA]

### Nets
3.3V: C2.1 C3.1 C21.1 C22.1 L4.2 Q1.2(E) R27.2 R28.2 R29.2 R30.2 R54.2 R73.2 R74.2 SW0.3 SW1.3 SW2.3 SW3.3 SW4.3 SW5.3 SW6.3 SW7.3 U2.4(V3) U2.16(VCC) U4.16(VDD)
3.3V: C1.1 U1.5(V+)
5V: D9.1(K) R81.1 C14.1 C23.1 C55.1 F1.2 R82.1 R85.1 U5.4(VIN) U6.4(VIN) U11.3(Vin)
FGPA1.2V: C10.1(+) C11.1 C12.1 C13.1 C48.1 C49.1 C50.1 C51.1 C52.1 C53.1 L1.2 R83.2 U7.G7(VCCINT) U7.G9(VCCINT) U7.H8(VCCINT) U7.H10(VCCINT) U7.J7(VCCINT) U7.J9(VCCINT) U7.K8(VCCINT) U7.K10(VCCINT)
FGPA3.3V: C4.1 C17.1(+) C18.1 C19.1 C20.1 C25.1 C26.1 C27.1 C28.1 C29.1 C30.1 C31.1 C32.1 C33.1 C34.1 C35.2 C36.1 C37.1 C38.1 C39.1 C40.1 C41.1 C42C?.1 C43.1 C44.1 C45.1 C47.1 C54.1 L3.2 L4.1 L5.2 R86.2 R88.2 R89.2 R90.2 R91.2 R92.1 R95.2 R96.2 R100.2 U7.B4(VCCO_0) U7.B9(VCCO_0) U7.B13(VCCO_0) U7.D2(VCCO_3) U7.D7(VCCO_0) U7.D10(VCCO_0) U7.D15(VCCO_1) U7.E5(VCCAUX) U7.F8(VCCAUX) U7.F11(VCCAUX) U7.G4(VCCO_3) U7.G10(VCCAUX) U7.G13(VCCO_1) U7.H6(VCCAUX) U7.J2(VCCO_3) U7.J10(VCCAUX) U7.J15(VCCO_1) U7.K4(VCCO_3) U7.K13(VCCO_1) U7.L6(VCCAUX) U7.L9(VCCAUX) U7.N2(VCCO_3) U7.N7(VCCO_2) U7.N10(VCCO_2) U7.N15(VCCO_1) U7.R4(VCCO_2) U7.R8(VCCO_2) U8.8(VCC) U30.5(VCC) Y3.1(E/C) Y3.4(VDD)
GND: D9.2(A) BUZZER1.2 C1.2 C2.2 C3.2 C4.2 C6.1 C8.1 C8.2 C9.1 C9.2 C10.2(-) C11.2 C12.2 C13.2 C14.2 C15.2 C16.2 C17.2(-) C18.2 C19.2 C20.2 C21.2 C22.2 C23.2 C24.2 C25.2 C26.2 C27.2 C28.2 C29.2 C30.2 C31.2 C32.2 C33.2 C34.2 C35.1 C36.2 C37.2 C38.2 C39.2 C40.2 C41.2 C42C?.2 C43.2 C44.2 C45.2 C47.2 C48.2 C49.2 C50.2 C51.2 C52.2 C53.2 C54.2 C55.2 C57.2 C64.2 C65.2 Config.2 D0.2(K) D1.2(K) D2.2(K) D3.2(K) D4.2(K) D5.2(K) D6.2(K) D7.2(K) D11.2(K) D12.2(K) D13.2(K) D14.2(K) DD1.2(A) J1.1 JTAG.5 JTAG.6 JTAG.7 JTAG.8 JTAG.9 JTAG.10 JTAG.11 P1.3 P1.4 P1.5 P1.7 P1.9 P1.11 P1.13 P1.15 P1.23 P1.24 P1.44 P1.57 P1.58 P2.2 P2.40 P3.1 P3.39 P4.3 P4.4 P4.6 P4.8 P4.10 P4.12 P4.14 P4.16 P4.18 P4.20 P4.30 P4.31 P4.32 P4.43 P4.44 P4.46 P4.57 P4.58 P5.3 P6.4 POWER1.2(K) POWER2.2(K) R3.2 R4.2 R11.2 R12.2 R19.2 R20.2 R23.2 R24.2 R63.1 R65.1 R69.1 R84.1 R87.1 R93.1 RSTn.2 T10.1 U1.2(V-) U2.1(GND) U3.2(GND) U4.5(VDDA) U4.29(GND) U5.2(GND) U6.2(GND) U7.A1(GND) U7.A16(GND) U7.B7(GND) U7.B11(GND) U7.D4(GND) U7.D13(GND) U7.E9(GND) U7.G2(GND) U7.G8(GND) U7.G15(GND) U7.H7(GND) U7.H9(GND) U7.H12(GND) U7.J5(GND) U7.J8(GND) U7.K7(GND) U7.K9(GND) U7.L2(GND) U7.L15(GND) U7.M8(GND) U7.N13(GND) U7.P3(GND) U7.R6(GND) U7.R10(GND) U7.T1(GND) U7.T16(GND) U8.4(GND) U11.1(GND) U30.2(GND) UART2USB?.5 UART2USB?.6 UART2USB?.7 UART2USB?.8 UART2USB?.9 UART2USB?.10 UART2USB?.11 Y3.2(GND)
OUT_3.3V: C15.1 C16.1 P1.59 P1.60 P2.1 P3.2 P4.59 P4.60 P5.1 P6.2 R101.1 U11.2(Vout) U11.4(NC)
RXD: U2.2(TXD) U2.3(RXD) U7.F12(IO_BE2P_0)
VBUS: C6.2 F1.1 JTAG.1 P1.1 P1.2 P2.39 P3.40 U3.5(VCC) UART2USB?.1
VBUS: P4.1 P4.2
DigitronCS_Out_2: DIG1.9(COM2)
A2: P5.11 P6.12 U7.A2(IO_R4N_3)
ADC VREF: C57.1 R101.2 U7.L11(ADC_VREF)
B1: P5.10 P6.9 U7.B1(IO_R_3)
B2: P5.12 P6.11 U7.B2(IO_R4P_3)
B3: P5.14 P6.13 U7.B3(IO_R1P_3)
BOOT: R65.2 T7.1 U4.1(BOOT0)
BUZZER: R55.1 U7.H11(IO_BE3N_0)
C1: P5.8 P6.7 R98.1 U7.C1(IO_R6P_3)  [also labelled LED13]
C2: P5.7 P6.8 R99.1 U7.C2(IO_R5N_3)  [also labelled LED14]
C3: P5.9 P6.10 U7.C3(IO_R5P_3)
C4: P5.16 P6.15 U7.C4(IO_BE26P_0,HSWAPEN)
C5: P5.18 P6.17 U7.C5(IO_BE21P_0)
C6: P5.19 P6.20 U7.C6(IO_BE19P_0)
C7: P5.24 P6.23 U7.C7(IO_BE19N_0)
CLOCK 24M: C64.1 U4.2(OSC_IN) Y0.2(OSC2)
Clock_3Hz: P5.2 P6.1 R102.1 U7.F5(IO_R3P_3)  [also labelled F5]
D1: P1.38 U7.D1(IO_R7N_3)
D3: P5.5 P6.6 R68.1 U7.D3(IO_R1N_3)  [also labelled LED11]
D5: P5.15 P6.16 U7.D5(IO_BE25P_0)
D6: P5.20 P6.19 U7.D6(IO_BE25N_0)
D8: P5.23 P6.24
D14: P4.53 U7.D14(IO_L16P_1)
D16: P4.56 U7.D16(IO_L16N_1)
DAC_VOUT: J1.2 R45.1 U1.4(OUT)
Digitron_Out_0: R5.1 U7.A4(IO_BE24N_0)
Digitron_Out_1: R6.1 U7.A6(IO_BE20N_0)
Digitron_Out_2: R7.1 U7.B8(IO_BE16N_0)
Digitron_Out_3: R8.1 U7.E8(IO_BE12N_GCLKIOB_2_0)
Digitron_Out_4: R13.1 U7.A7(IO_BE18N_0)
Digitron_Out_5: R14.1 U7.B5(IO_BE26N_0)
Digitron_Out_6: R15.1 U7.A8(IO_BE18P_0)
Digitron_Out_7: R16.1 U7.C8(IO_BE16P_0)
DigitronCS_Out_0: DIG1.6(COM4) U7.C9(IO_BE10N_GCLKIOB_4_0)
DigitronCS_Out_1: DIG1.8(COM3) U7.B6(IO_BE21N_0)
DigitronCS_Out_2: U7.A5(IO_BE20P_0)
DigitronCS_Out_3: DIG1.12(COM1) U7.A3(IO_BE24P_0)
DONE: ?.2(K) R90.1 U7.P13(IO_L3P_1,DONE)
E1: P1.36 U7.E1(IO_R7P_3)
E2: P1.35 U7.E2(IO_R6N_3) U7.F2(IO_R8N_3)
E3: P5.4 P6.3 R100.1 RSTn.1 U7.E3(IO_R2P_3)
E4: P5.6 P6.5 R94.1 U7.E4(IO_R2N_3)  [also labelled LED12]
E6: P5.17 P6.18 U7.E6(IO_BE23P_0)
E7: P5.21 P6.22 U7.E7(IO_BE22N_0)
E15: P4.55 U7.E15(IO_L17N_1)
F1: P1.34 U7.F1(IO_R8P_3)
F2: P1.33
F3: P1.56 U7.F3(IO_R_3)
F4: P1.55 U7.F4(IO_R3N_3)
F6: P5.13 P6.14 U7.F6(IO_BE23N_0)
F7: P5.22 P6.21 U7.F7(IO_BE22P_0)
F13: P4.52 U7.F13(IO_L12P_1)
F14: P4.51 U7.F14(IO_L12N_1)
F15: P4.54 U7.F15(IO_L17P_1)
FGPA CCLK: U7.R11(IO_T_2,CCLK) U8.6(CLK)
FGPA DO: U7.P10(IO_T_2,D0_DIN_MISO)
FGPA GCLK1: R97.2 U7.R7(IO_TE11P_GCLKIOT_5_2)
FGPA MOSI: U7.T10(IO_T_2,MOSI_CSI_B)
FGPA_DO: U8.2(DO/IO1)
FGPA_MOSI: U8.5(DI/IO0)
G1: P1.31 U7.G1(IO_R10P_3)
G3: P1.54 U7.G3(IO_R10N_3)
G5: P1.53 U7.G5(IO_R9P_3)
G6: P1.51 U7.G6(IO_R9N_3)
G11: P4.39 U7.G11(IO_L13N_1)
G12: P4.50 U7.G12(IO_L13P_1)
G14: P4.49 U7.G14(IO_L11N_1)
G16: P4.41 U7.G16(IO_L18P_1)
H1: P1.29 U7.H1(IO_R11P_3)
H2: P1.32 U7.H2(IO_R13P_GCLKIOR_7_3)
H3: P1.49 U7.H3(IO_R14N_GCLKIOR_0_3)
H4: P1.52 U7.H4(IO_R14P_GCLKIOR_1_3)
H5: P1.50 U7.H5(IO_R11N_3)
H13: P4.48 U7.H13(IO_L9P_1)
H14: P4.47 U7.H14(IO_L_1)
H15: P4.42 U7.H15(IO_L11P_1)
H16: P4.45 U7.H16(IO_L18N_1)
INIT B: R91.1 U7.R3(IO_T_2,INIT_B)
J1: P1.30 U7.J1(IO_R12N_3)
J3: P1.19 U7.J3(IO_R15P_GCLKIOR_5_3)
J4: P1.17 U7.J4(IO_R15N_GCLKIOR_4_3)
J6: P1.47 U7.J6(IO_R17N_3)
J11: P4.40 U7.J11(IO_L4N_1)
J12: P4.29 U7.J12(IO_L8N_GCLKIOL_2_1)
J13: P4.33 U7.J13(IO_L9N_1)
J14: P4.36 U7.J14(IO_L_1)
J16: P4.35 U7.J16(IO_L15P_1)
JTAG TCK: T12.1
JTAG TDI: T14.1
JTAG TDO: T13.1
JTAG TMS: T11.1
K1: P1.27 U7.K1(IO_R12P_3)
K2: P1.28 U7.K2(IO_R16N_3)
K3: P1.48 U7.K3(IO_R16P_3)
K5: P1.45 U7.K5(IO_R17P_3)
K6: P1.46 U7.K6(IO_R21P_3)
K11: P4.26 U7.K11(IO_L4P_1)
K12: P4.27 U7.K12(IO_L8P_GCLKIOL_3_1)
K14: P4.34 U7.K14(IO_L_GCLKIOL_4_1)
K15: P4.38 U7.K15(IO_L7P_1)
K16: P4.37 U7.K16(IO_L15N_1)
Key_Co11: U7.D11(IO_BE4P_0)
Key_Col0: R44.1 U7.E11(IO_BE5P_0)
Key_Col1: R43.1
Key_Col2: R42.1 U7.C11(IO_BE8P_0)
Key_Col3: R41.1 U7.F10(IO_BE3P_0)
Key_Row0: R40.1 U7.E10(IO_BE5N_0)
Key_Row1: R39.1 U7.C10(IO_BE7N_0)
Key_Row2: R36.1 U7.F9(IO_BE9P_GCLKIOB_1_0)
Key_Row3: R33.1 U7.D9(IO_BE9N_GCLKIOB_0_0)
L1: U7.L1(IO_R13N_GCLKIOR_6_3)
L3: P1.41 U7.L3(IO_R20P_3)
L4: P1.42 U7.L4(IO_R_3)
L5: P1.26 U7.L5(IO_R_3)
L7: P2.19 P3.20 U7.L7(IO_TE9N_2,D6)
L8: U7.L8(IO_TE9P_2,D5)
L10: P1.25 P3.31 U7.L10(IO_T_2,ADC_CH_2)
L12: P4.7 U7.L12(IO_L2P_1)
L13: P4.25 U7.L13(IO_L5P_1)
L14: P4.28 U7.L14(IO_L6P_1)
L16: P4.19 U7.L16(IO_L14P_1)
LED0: R25.1 R53.2 U7.B14(IO_BE14P_0)
LED1: R26.1 R52.2 U7.B15(IO_BE15N_0)
LED2: R31.1 R51.2 U7.B16(IO_BE15P_0)
LED3: R32.1 R50.2 U7.C15(IO_BE13N_0)
LED4: R34.1 R49.2 U7.C16(IO_BE13P_0)
LED5: R35.1 R48.2 U7.E13(IO_BE6P_0)
LED6: R37.1 R47.2 U7.E16(IO_BE1P_0)
LED7: R38.1 R46.2 U7.F16(IO_BE1N_0)
LINK STATE: R71.1 R72.2 U4.17(PA9)
M1: U7.M1(IO_R24N_3)
M2: P1.39 U7.M2(IO_R20N_3)
M3: P1.40 U7.M3(IO_R21N_3)
M4: P1.22 U7.M4(IO_R22P_3)
M5: P1.37 U7.M5(IO_R_3)
M6: P3.15 U7.M6(IO_TE4P_2)
M7: P3.19 U7.M7(IO_TE5N_2)
M9: P2.29 P3.30 U7.M9(IO_TE10N_GCLKIOT_6_2)
M10: P1.16 P2.33 P3.34 U7.M10(IO_TE17P_2,ADC_CH_1)
M11: P4.5 U7.M11(IO_L2N_1)
M12: P2.35 P3.36 U7.M12(IO_TE19P_2,ADC_CH_4)
M13: P4.24 U7.M13(IO_L5N_1)
M14: P4.23 U7.M14(IO_L6N_1)
M15: P4.22 U7.M15(IO_L7N_1)
M16: P4.17 U7.M16(IO_L14N_1)
MSEL0: R92.2 U7.T11(IO_T_2,M0)
MSEL1: R93.2 U7.N11(IO_T_2,ADC_CH_0,M1)
N1: U7.N1(IO_R24P_3)
N3: P1.21 U7.N3(IO_R22N_3)
N4: P1.20 U7.N4(IO_R23N_3)
N5: P3.13 U7.N5(IO_TE3P_2,D3)
N6: P2.17 P3.18 U7.N6(IO_TE4N_2)
N8: P2.27 P3.28 U7.N8(IO_TE7N_2)
N9: P3.29 U7.N9(IO_TE12P_GCLKIOT_1_2)
N12: P1.14 P3.35 U7.N12(IO_TE18P_2,D1,ADC_CH_5)
N14: P4.13 U7.N14(IO_L10P_1)
N16: P4.15 U7.N16(IO_L10N_1)
OSC OUT: C65.1 U4.3(OSC_OUT) Y0.1(OSC1)
P1: P1.12 U7.P1(IO_R18P_3)
P2: P1.8 U7.P2(IO_R19N_3)
P4: P1.18 U7.P4(IO_R23P_3)
P5: P2.15 P3.16 U7.P5(IO_TE3N_2,D4)
P6: P3.17 U7.P6(IO_TE1P_2)
P7: P2.25 U7.P7(IO_TE10P_GCLKIOT_7_2)
P8: P3.27 U7.P8(IO_TE6N_2)
P9: P2.31 P3.32 U7.P9(IO_TE8N_2)
P11: P3.33 U7.P11(IO_TE17N_2,ADC_CH_3)
P12: P2.37 P3.38 U7.P12(IO_TE18N_2,D2,ADC_CH_6)
P14: P4.21 U7.P14(IO_L3N_1)
P15: P4.9 U7.P15(IO_L1N_1)
P16: P4.11 U7.P16(IO_L1P_1)
PROGRAM B: C24.1 Config.1 R88.1 U7.T2(IO_T_2,PROGRAM_B)
R1: P1.10 U7.R1(IO_R18N_3)
R2: P1.6 U7.R2(IO_R19P_3)
R5: P3.3 U7.R5(IO_TE6P_2,D7)
R9: P3.9 U7.R9(IO_TE8P_2)
R12: P3.11 U7.R12(IO_TE16N_2)
R14: P3.21 U7.R14(IO_TE16P_2)
R15: P3.23 U7.R15(IO_TE15P_2)
R16: P3.37 U7.R16(IO_TE19N_2,ADC_CH_7)
SPI CSN: U7.T3(IO_T_2,CSO_B) U8.1(~{CS})
SW0: R1.1 U7.A9(IO_BE11N_GCLKIOB_6_0)
SW1: R2.1 U7.A10(IO_BE11P_GCLKIOB_7_0)
SW2: R9.1 U7.B10(IO_BE10P_GCLKIOB_5_0)
SW3: R10.1 U7.A11(IO_BE8N_0)
SW4: R17.1 U7.A12(IO_BE17N_0)
SW5: R18.1 U7.B12(IO_BE7P_0)
SW6: R21.1 U7.A13(IO_BE17P_0)
SW7: R22.1 U7.A14(IO_BE14N_0)
T4: P2.3 P3.4 U7.T4(IO_TE1N_2)
T5: P2.5 P3.6 U7.T5(IO_TE2P_2)
T6: P3.5 U7.T6(IO_TE2N_2)
T7: P2.7 P3.8 U7.T7(IO_TE11N_GCLKIOT_4_2)
T8: P3.7 U7.T8(IO_TE12N_GCLKIOT_0_2)
T9: P2.9 P3.10 U7.T9(IO_TE7P_2)
T12: P2.11 P3.12 U7.T12(IO_TE5P_2)
T13: P2.13 P3.14
T14: P2.21 P3.22 U7.T14(IO_TE13P_GCLKIOT_3_2)
T15: P2.23 P3.24 U7.T15(IO_TE15N_2)
TXD: U7.D12(IO_BE4N_0)
UART RX: R80.1
UART TX: R75.1
UART_RX: U7.E12(IO_BE2N_0)
UART_TX: U7.C13(IO_BE6N_0)
USART RX: R70.2
USART TX: R71.2 T8.1 T9.1
USB2 D1+: U2.5(D+)
USB2 D1-: U2.6(D-)
USB2 DI+: U3.3(IO2) UART2USB?.3
USB2 DI-: U3.1(IO1) UART2USB?.2
USB D+: JTAG.3 R66.2 U3.4(IO3)
USB D-: JTAG.2 R67.2 U3.6(IO4)
USB JTAG TCK: U4.11(PA5)
USB JTAG TDI: U4.13(PA7)
USB JTAG TDO: U4.12(PA6)
USB JTAG TMS: U4.10(PA4)
USB_JTAG_TCK: R74.1 R77.1
USB_JTAG_TDI: R73.1 R79.1
USB_JTAG_TMS: R76.1
USB_JTAG_TO: R78.1
Y13: U7.T13(IO_TE13N_GCLKIOT_2_2)
NetR81_2: R81.2 POWER2.1(A)
Net?_1: ?.1(A) R89.1
NetBUZZER1_1: BUZZER1.1 DD1.1(K) Q1.3(C)
NetD0_1: D0.1(A) R25.2
NetD1_1: D1.1(A) R26.2
NetD2_1: D2.1(A) R31.2
NetD3_1: D3.1(A) R32.2
NetD4_1: D4.1(A) R34.2
NetD5_1: D5.1(A) R35.2
NetD6_1: D6.1(A) R37.2
NetD7_1: D7.1(A) R38.2
NetD11_1: D11.1(A) R68.2
NetD12_1: D12.1(A) R94.2
NetD13_1: D13.1(A) R98.2
NetD14_1: D14.1(A) R99.2
NetDIG1_1: DIG1.1(E) R13.2
NetDIG1_2: DIG1.2(D) R8.2
NetDIG1_3: DIG1.3(DOT) R16.2
NetDIG1_4: DIG1.4(C) R7.2
NetDIG1_5: DIG1.5(G) R15.2
NetDIG1_7: DIG1.7(B) R6.2
NetDIG1_10: DIG1.10(F) R14.2
NetDIG1_11: DIG1.11(A) R5.2
NetKEY0_1: KEY0.1 KEY1.1 KEY2.1 KEY3.1 R40.2
NetKEY0_2: KEY0.2 KEY4.2 KEY8.2 KEY12.2 R30.1 R44.2
NetKEY1_2: KEY1.2 KEY5.2 KEY9.2 KEY13.2 R29.1 R43.2
NetKEY2_2: KEY2.2 KEY6.2 KEY10.2 KEY14.2 R28.1 R42.2
NetKEY3_2: KEY3.2 KEY7.2 KEY11.2 KEY15.2 R27.1 R41.2
NetKEY4_1: KEY4.1 KEY5.1 KEY6.1 KEY7.1 R39.2
NetKEY8_1: KEY8.1 KEY9.1 KEY10.1 KEY11.1 R36.2
NetKEY12_1: KEY12.1 KEY13.1 KEY14.1 KEY15.1 R33.2
NetL1_1: L1.1 U5.3(LX)
NetL3_1: L3.1 U6.3(LX)
NetL5_1: L5.1 U7.R13(ADC_VDDA)
NetPOWER1_1: POWER1.1(A) R72.1
NetQ1_1: Q1.1(B) R54.1 R55.2
NetR1_2: R1.2 SW0.2
NetR2_2: R2.2 SW1.2
NetR3_1: R3.1 SW0.1
NetR4_1: R4.1 SW1.1
NetR9_2: R9.2 SW2.2
NetR10_2: R10.2 SW3.2
NetR11_1: R11.1 SW2.1
NetR12_1: R12.1 SW3.1
NetR17_2: R17.2 SW4.2
NetR18_2: R18.2 SW5.2
NetR19_1: R19.1 SW4.1
NetR20_1: R20.1 SW5.1
NetR21_2: R21.2 SW6.2
NetR22_2: R22.2 SW7.2
NetR23_1: R23.1 SW6.1
NetR24_1: R24.1 SW7.1
NetR45_2: R45.2 U1.3(IN-)
NetR46_1: R46.1 R56.1 U1.1(IN+)
NetR47_1: R47.1 R56.2 R57.1
NetR48_1: R48.1 R57.2 R58.1
NetR49_1: R49.1 R58.2 R59.1
NetR50_1: R50.1 R59.2 R60.1
NetR51_1: R51.1 R60.2 R61.1
NetR52_1: R52.1 R61.2 R62.1
NetR53_1: R53.1 R62.2 R63.2
NetR66_1: R66.1 R?.2 U4.20(PA12)
NetR67_1: R67.1 U4.19(PA11)
NetR69_2: R69.2 U4.4(NRST)
NetR70_1: R70.1 U4.18(PA10)
NetR75_2: R75.2 U4.8(PA2)
NetR76_2: R76.2 U7.A15(IO_L_1,TMS)
NetR77_2: R77.2 U7.C14(IO_B_0,TCK)
NetR78_2: R78.2 U7.E14(IO_L_1,TDO)
NetR79_2: R79.2 U7.C12(IO_B_0,TDI)
NetR80_2: R80.2 U4.9(PA3)
NetR83_1: R83.1 R84.2 U5.5(FB)
NetR85_2: R85.2 U6.1(EN)
NetR86_1: R86.1 R87.2 U6.5(FB)
NetR95_1: R95.1 U8.7(~{HOLD}/IO3)
NetR96_1: R96.1 U8.3(~{WP}/IO2)
NetR97_1: R97.1 Y3.3(OUT)
NetR102_2: R102.2 U30.1(IO1)
NetR?_1: R?.1 U4.24(PB3)
NetT1_1: T1.1 U4.28(PB7)
NetT2_1: T2.1 U4.27(PB6)
NetT3_1: T3.1 U4.26(PB5)
NetT4_1: T4.1 U4.25(PB4)
NetT5_1: T5.1 U4.22(PA14)
NetT6_1: T6.1 U4.21(PA13)

Not connected (* = marked no-connect by the designer): JTAG 4; P1 43; P2 4 6 8 10 12 14 16 18 20 22 24 26 28 30 32 34 36 38; P3 25 26; R82 2; U2 7(XI) 8(XO) 9(CTS#) 10(DSR#) 11(RI#) 12(DCD#) 13(DTR#) 14(RTS#) 15(R232); U4 6(PA0) 7(PA1) 14(PB0) 15(PB1) 23(PA15); U5 1(EN); U7 D8(IO_BE12P_GCLKIOB_3_0); U30 3(IO2) 4(IO3) 6(IO4); UART2USB? 4

### Notes on the sheet
- Labels drawn without touching a wire or pin: L8, L10, M6, M7, N5, N9, N12, P6, P8, P11, R5, R9, R12, R14, R15, R16, T6, T8
- (in symbol EG4S20BG256, part A) BANK0
- (in symbol EG4S20BG256, part B) BANK1
- (in symbol EG4S20BG256, part C) BANK2
- (in symbol EG4S20BG256, part D) BANK3
- (in symbol EG4S20BG256, part E) Config
- (in symbol EG4S20BG256, part F) POWER